# Altium schematic sheet FOTA Micro Controller.SchDoc: FOTA MicroController
size 292 x 193 mm; SheetNumber: 22; SheetTotal: 28
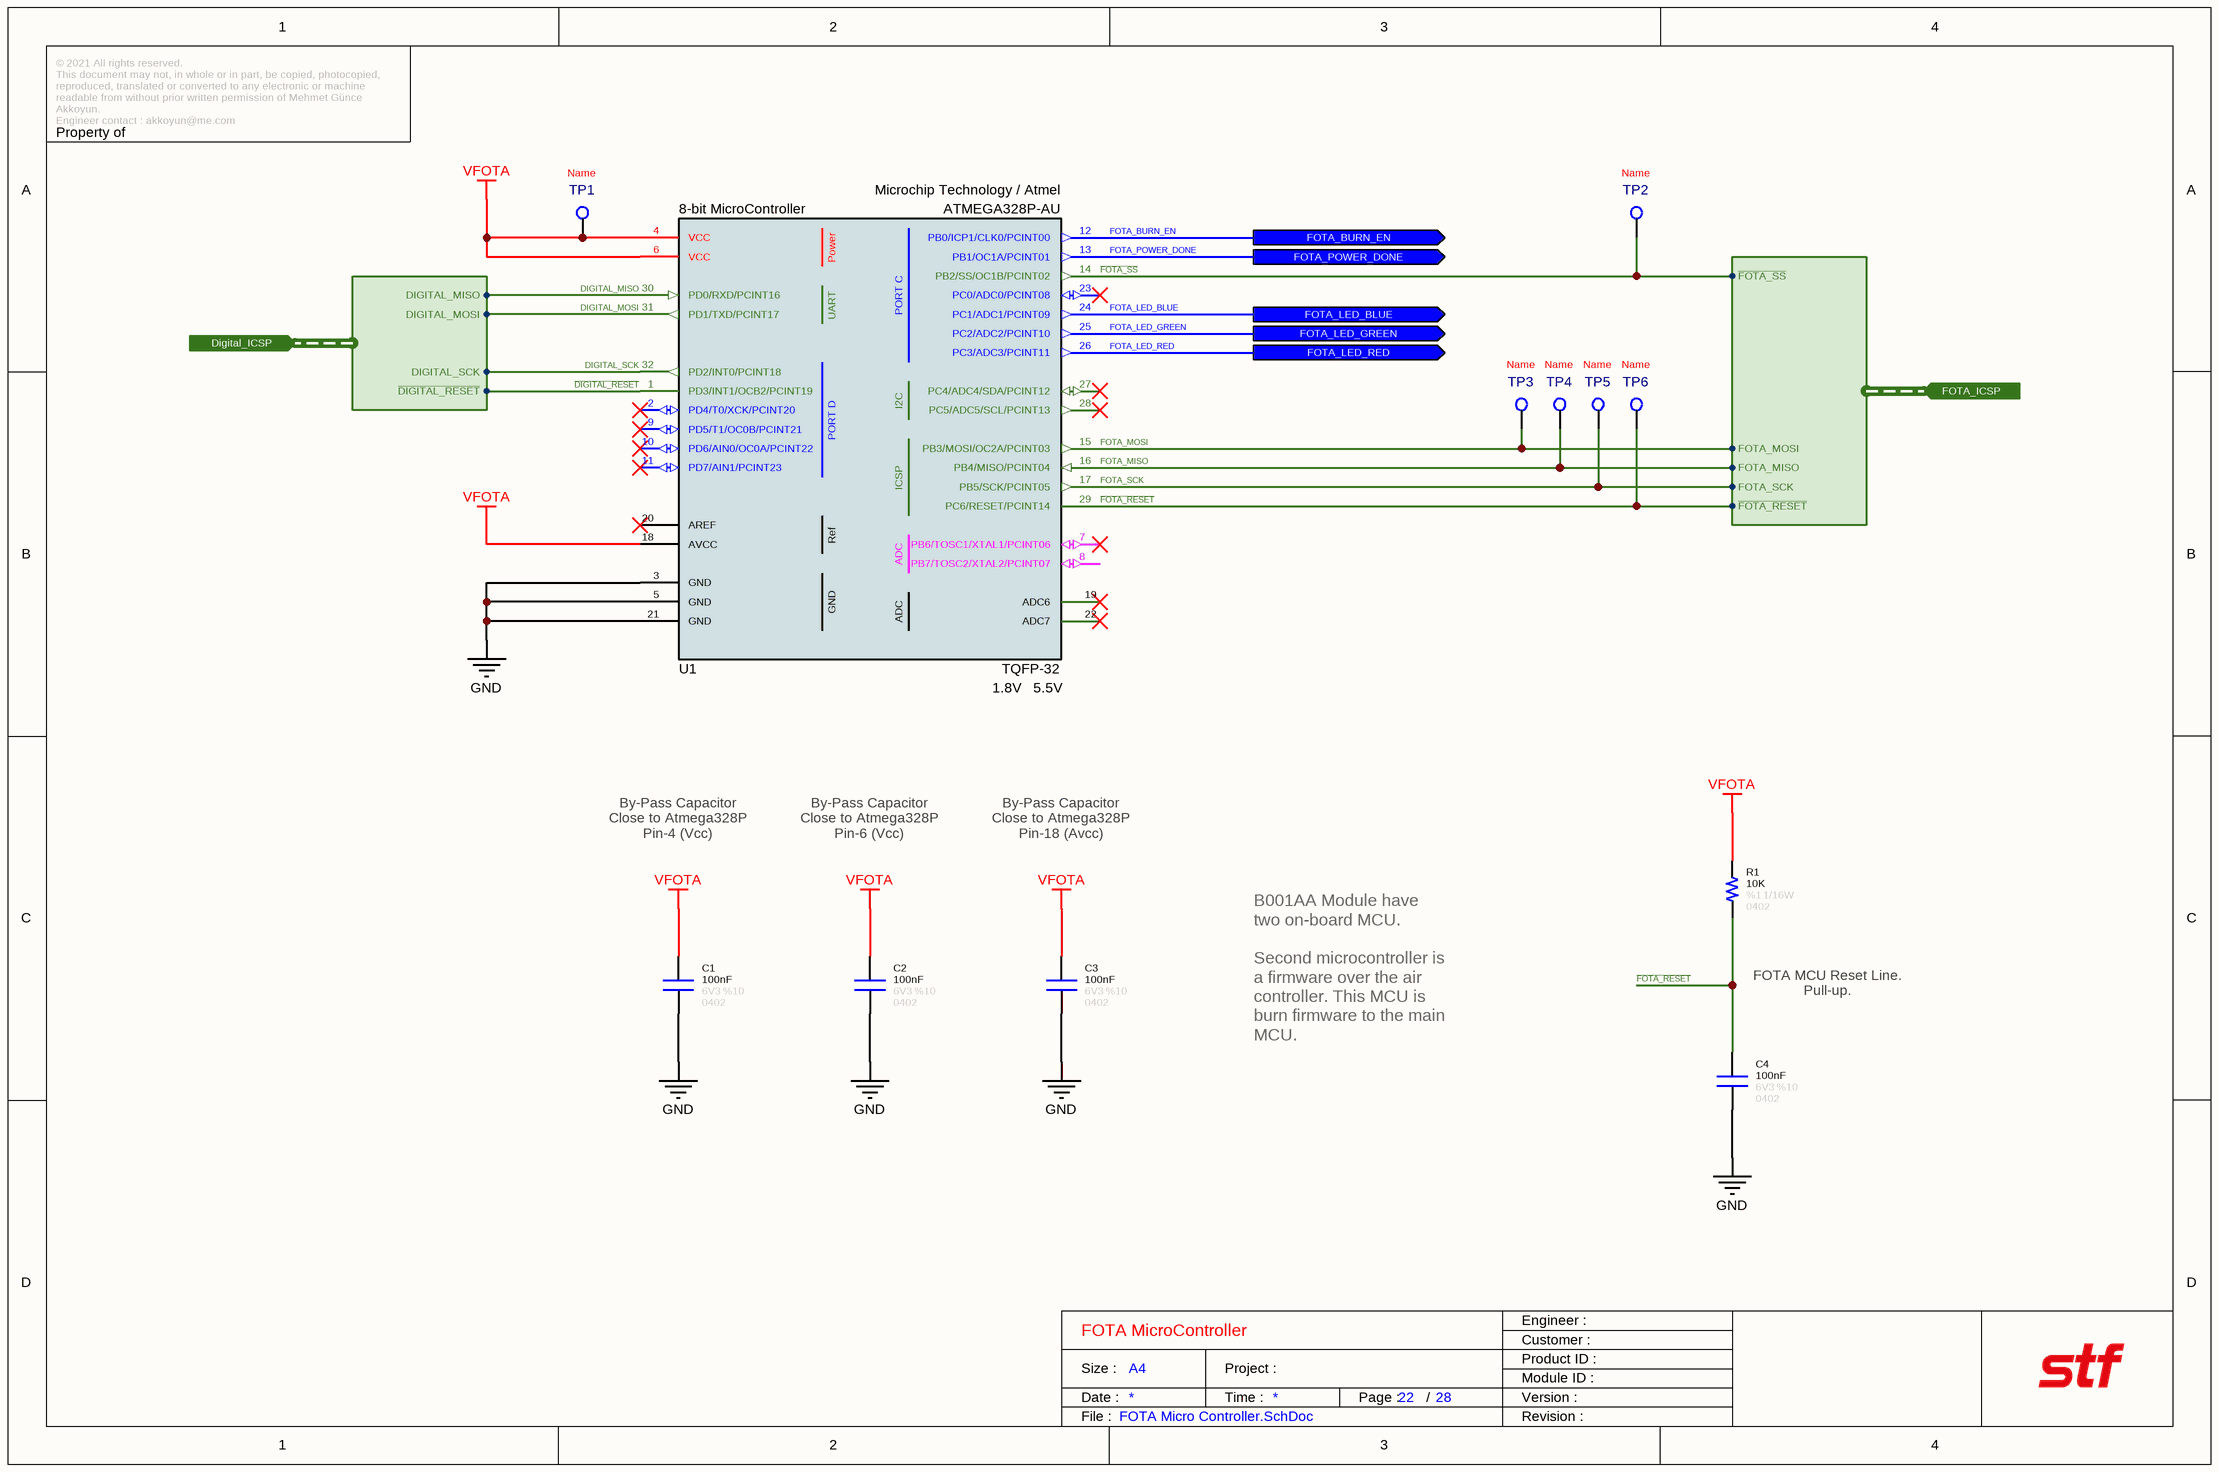
[diagram p0: FOTA Micro Controller.SchDoc]

## Parts
C1  value 100nF  Tolerance: %10  Voltage: 6V3  Case: 0402  [CAPACITOR_0402]  (hidden comment: Capacitor - 100nF [0402] (Ceramic))
C2  value 100nF  Tolerance: %10  Voltage: 6V3  Case: 0402  [CAPACITOR_0402]  (hidden comment: Capacitor - 100nF [0402] (Ceramic))
C3  value 100nF  Tolerance: %10  Voltage: 6V3  Case: 0402  [CAPACITOR_0402]  (hidden comment: Capacitor - 100nF [0402] (Ceramic))
C4  value 100nF  Tolerance: %10  Voltage: 6V3  Case: 0402  [CAPACITOR_0402]  (hidden comment: Capacitor - 100nF [0402] (Ceramic))
R1  value 10K  Tolerance: %1  Case: 0402  Power: 1/16W  [RESISTOR_0402]  (hidden comment: 10K - 0402 - %1 - 1/16W)
TP1  PCB - Test Point  [Test_Point]  (value not drawn)  (no BOM)
TP2  PCB - Test Point  [Test_Point]  (value not drawn)  (no BOM)
TP3  PCB - Test Point  [Test_Point]  (value not drawn)  (no BOM)
TP4  PCB - Test Point  [Test_Point]  (value not drawn)  (no BOM)
TP5  PCB - Test Point  [Test_Point]  (value not drawn)  (no BOM)
TP6  PCB - Test Point  [Test_Point]  (value not drawn)  (no BOM)
U1  8-bit MicroController  Supply Voltage - Max: 5.5V  Supply Voltage - Min: 1.8V  Manufacturer Name: Microchip Technology / Atmel  Manufacturer Part Number: ATMEGA328P-AU  Case: TQFP-32  [TQFN-32]

## Ports
Digital_ICSP (in, harness Digital_ICSP), FOTA_BURN_EN (out), FOTA_ICSP (in, harness FOTA_ICSP), FOTA_LED_BLUE (out), FOTA_LED_GREEN (out), FOTA_LED_RED (out), FOTA_POWER_DONE (out)

## Harnesses
Digital_ICSP: ~{DIGITAL_RESET}, DIGITAL_SCK, DIGITAL_MOSI, DIGITAL_MISO
FOTA_ICSP: ~{FOTA_SS}, FOTA_MOSI, FOTA_MISO, FOTA_SCK, ~{FOTA_RESET}

## Nets
GND: C1.1 C2.1 C3.1 C4.1 U1.3(GND) U1.5(GND) U1.21(GND)
VFOTA: C1.2 C2.2 C3.2 R1.2 TP1.1 U1.4(VCC) U1.6(VCC) U1.18(AVCC)
~{DIGITAL_RESET}: U1.1(PD3/INT1/OCB2/PCINT19) ; port Digital_ICSP.~{DIGITAL_RESET}
DIGITAL_MISO: U1.30(PD0/RXD/PCINT16) ; port Digital_ICSP.DIGITAL_MISO
DIGITAL_MOSI: U1.31(PD1/TXD/PCINT17) ; port Digital_ICSP.DIGITAL_MOSI
DIGITAL_SCK: U1.32(PD2/INT0/PCINT18) ; port Digital_ICSP.DIGITAL_SCK
~{FOTA_RESET}: C4.2 R1.1 TP6.1 U1.29(PC6/RESET/PCINT14) ; port FOTA_ICSP.~{FOTA_RESET}
~{FOTA_SS}: TP2.1 U1.14(PB2/SS/OC1B/PCINT02) ; port FOTA_ICSP.~{FOTA_SS}
FOTA_BURN_EN: U1.12(PB0/ICP1/CLK0/PCINT00) ; port FOTA_BURN_EN
FOTA_LED_BLUE: U1.24(PC1/ADC1/PCINT09) ; port FOTA_LED_BLUE
FOTA_LED_GREEN: U1.25(PC2/ADC2/PCINT10) ; port FOTA_LED_GREEN
FOTA_LED_RED: U1.26(PC3/ADC3/PCINT11) ; port FOTA_LED_RED
FOTA_MISO: TP4.1 U1.16(PB4/MISO/PCINT04) ; port FOTA_ICSP.FOTA_MISO
FOTA_MOSI: TP3.1 U1.15(PB3/MOSI/OC2A/PCINT03) ; port FOTA_ICSP.FOTA_MOSI
FOTA_POWER_DONE: U1.13(PB1/OC1A/PCINT01) ; port FOTA_POWER_DONE
FOTA_SCK: TP5.1 U1.17(PB5/SCK/PCINT05) ; port FOTA_ICSP.FOTA_SCK

Not connected (* = marked no-connect by the designer): U1 2(PD4/T0/XCK/PCINT20)* 7(PB6/TOSC1/XTAL1/PCINT06)* 8(PB7/TOSC2/XTAL2/PCINT07) 9(PD5/T1/OC0B/PCINT21)* 10(PD6/AIN0/OC0A/PCINT22)* 11(PD7/AIN1/PCINT23)* 19(ADC6)* 20(AREF)* 22(ADC7)* 23(PC0/ADC0/PCINT08)* 27(PC4/ADC4/SDA/PCINT12)* 28(PC5/ADC5/SCL/PCINT13)*

## Notes on the sheet
- By-Pass Capacitor
  Close to Atmega328P
  Pin-4 (Vcc)
- By-Pass Capacitor
  Close to Atmega328P
  Pin-6 (Vcc)
- By-Pass Capacitor
  Close to Atmega328P
  Pin-18 (Avcc)
- FOTA MCU Reset Line. Pull-up.
- B001AA Module have two on-board MCU.
  Second microcontroller is a firmware over the air controller. This MCU is burn firmware to the main MCU.
- © 2021 All rights reserved.
  This document may not, in whole or in part, be copied, photocopied, reproduced, translated or converted to any electronic or machine readable from without prior written permission of Mehmet Günce Akkoyun.
  Engineer contact : akkoyun@me.com
- Property of
- Engineer :
- Date :
- Size :
- A4
- Time :
- Project :
- Page :
- /
- Customer :
- Product ID :
- Module ID :
- Version :
- File :
- Revision :
- (in symbol IC - ATMEGA328P-AU) Power; PORT C; UART; I2C; PORT D; ICSP; Ref; ADC

## Library data of the parts
C1-C4 = Capacitor - 100nF [0402-6V3]: Capacitor - 100nF [0402-6V3] (Ceramic); Manufacturer Name: AVX; Manufacturer Part Number: 04026D104KAT4A; ComponentLink1Description: Mouser; ComponentLink1URL: https://www.mouser.com.tr/ProductDetail/AVX/04026D104KAT4A?qs=sGAEpiMZZMs0AnBnWHyRQPg4iYkCw7IMED%2F4kpqgf7w%3D; ComponentLink2Description: DataSheet; ComponentLink2URL: https://www.mouser.com.tr/datasheet/2/40/cx5r-776519.pdf
R1 = Resistor - 10K [0402]: Thick Film Resistors - SMD 1/16 W 10 KOhm 1%; Manufacturer Name: Vishay; Manufacturer Part Number: CRCW040210K0FKED; ComponentLink1Description: DataSheet; ComponentLink1URL: https://www.mouser.com.tr/datasheet/2/427/dcrcwe3-1762152.pdf; ComponentLink2Description: Mouser; ComponentLink2URL: https://www.mouser.com.tr/ProductDetail/Vishay-Dale/CRCW040210K0FKED?qs=sGAEpiMZZMu61qfTUdNhG2DpbjADlD3GcalbOv9utCY%3D
TP1-TP6 = PCB - Test Point: Test Point; Name: Name
U1 = IC - ATMEGA328P-AU: 8-bit Microcontrollers - MCU 32KB In-system Flash 20MHz 1.8V-5.5V; Height: 1mm; ComponentLink1Description: DataSheet; ComponentLink1URL: http://ww1.microchip.com/downloads/en/DeviceDoc/ATmega48A-PA-88A-PA-168A-PA-328-P-DS-DS40002061A.pdf; ROHS: Yes; Minimum Operating Temperature: -40; Maximum Operating Temperature: +85; ComponentLink2Description: Mouser; ComponentLink2URL: https://www.mouser.com.tr/ProductDetail/Microchip-Technology-Atmel/ATMEGA328P-AU?qs=sGAEpiMZZMtVoztFdqDXO3RbBx7FKCmV; ComponentLink3Description: ProductPage; ComponentLink3URL: https://www.microchip.com/wwwproducts/en/ATmega328p